# EAGLE design Baseboard_XIAO (EAGLE 9.5.2)
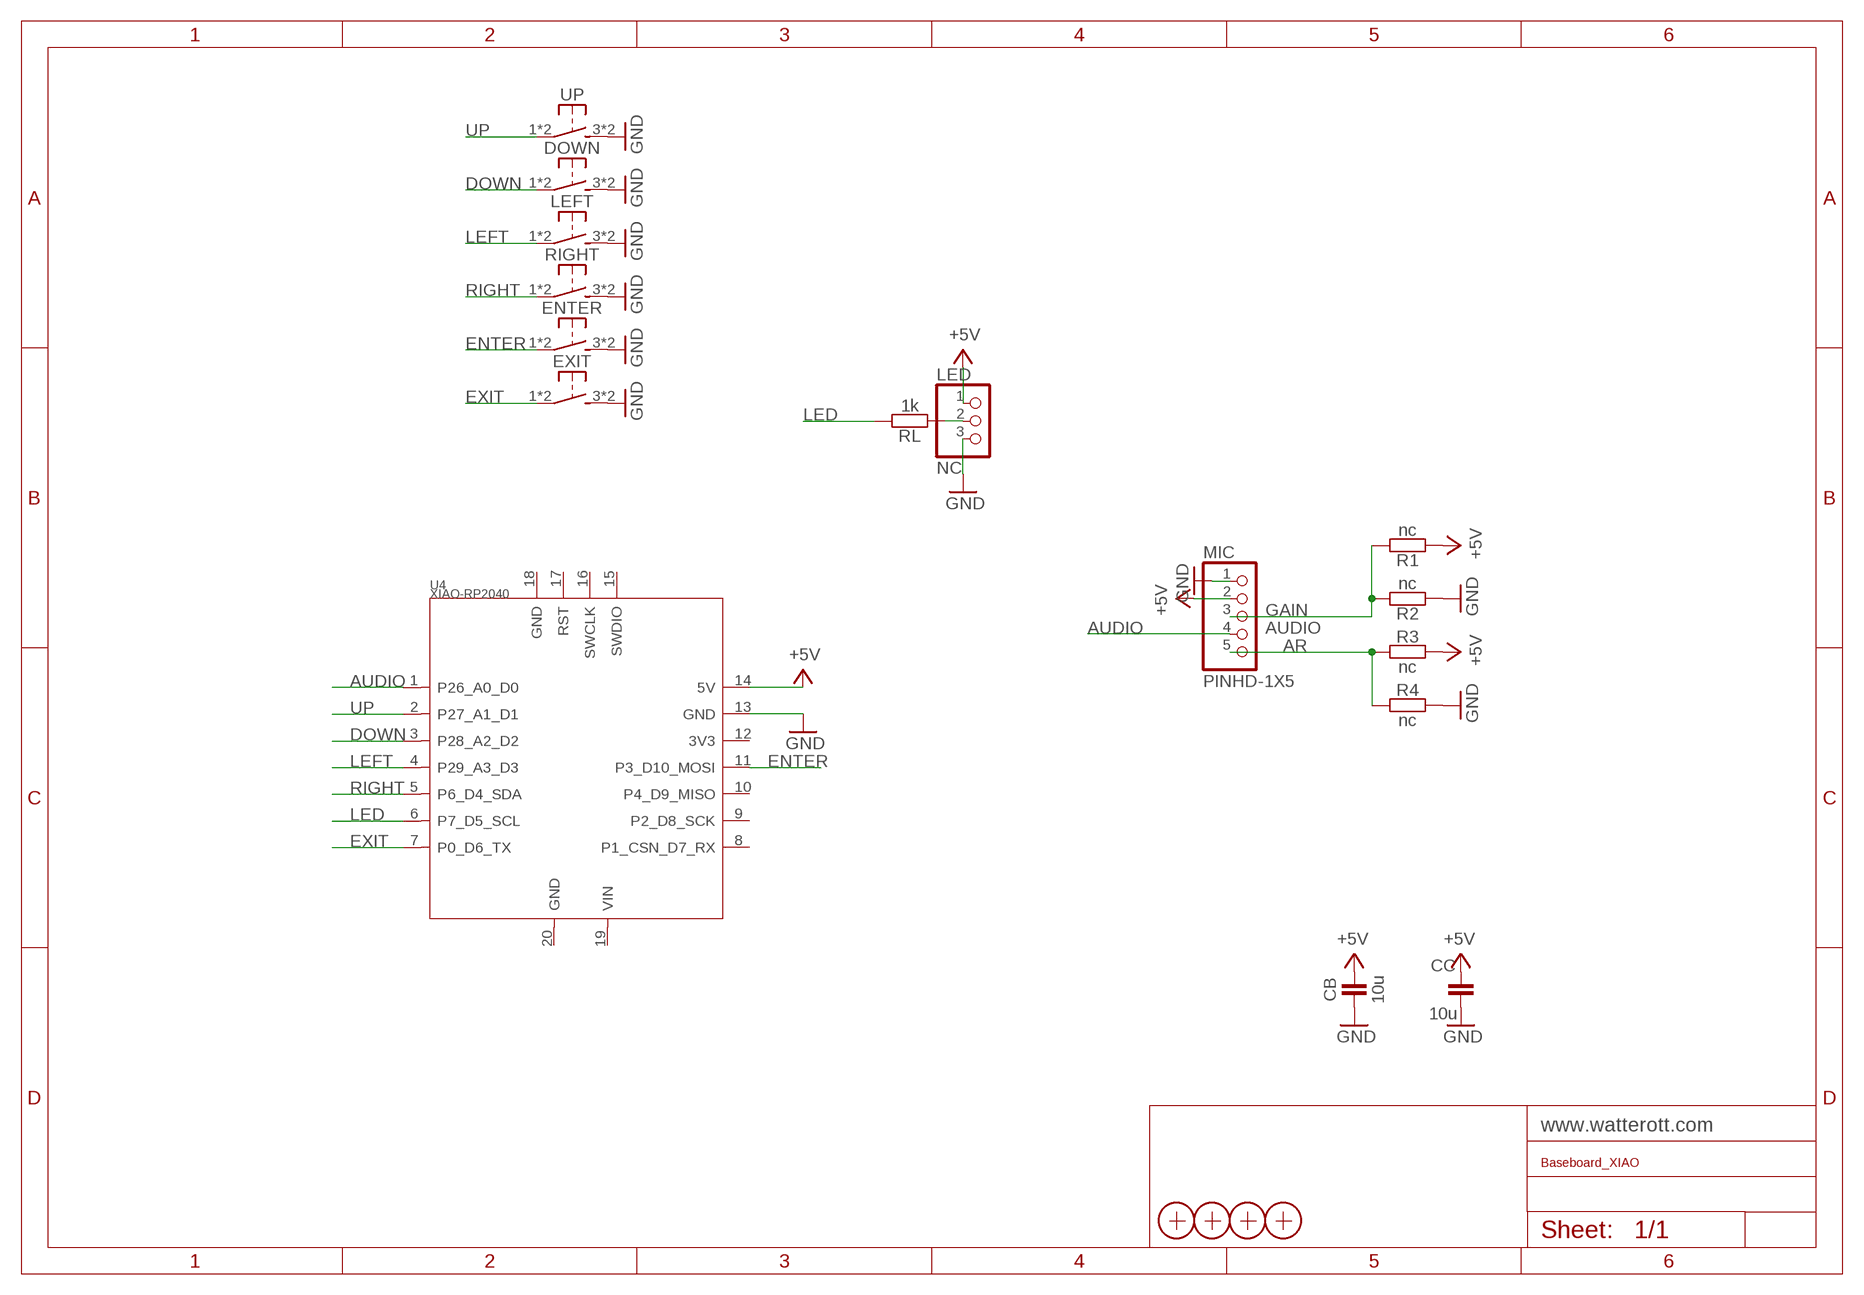
[diagram p0: schematic, sheet 1]

## Parts
CB  10u  CAPACITOR-0603  [C0603]
CC  10u  CAPACITOR-0603  [C0603]
DOWN  SW-TACTILELSH  [SW6XG_LSH]
ENTER  SW-TACTILELSH  [SW6XG_LSH]
EXIT  SW-TACTILELSH  [SW6XG_LSH]
LED  NC  PINHD-1X3  [1X03]
LEFT  SW-TACTILELSH  [SW6XG_LSH]
MIC  PINHD-1X5  [1X05]
R1  nc  RESISTOR-0603  [C0603]
R2  nc  RESISTOR-0603  [C0603]
R3  nc  RESISTOR-0603  [C0603]
R4  nc  RESISTOR-0603  [C0603]
RIGHT  SW-TACTILELSH  [SW6XG_LSH]
RL  1k  RESISTOR-0603  [C0603]
U4  XIAO-RP2040  [XIAO-SAMD21/RP2040-MODULE14P-2.54-21X17.8MM]
UP  SW-TACTILELSH  [SW6XG_LSH]
X1  PASSER-07  [PASSER_07MM]
X2  PASSER-07  [PASSER_07MM]
X3  PASSER-07  [PASSER_07MM]
X4  PASSER-07  [PASSER_07MM]

## Nets
+5V: CB.2 CC.2 LED.1 MIC.2 R1.1 R3.2 U4.14(5V)
AR: MIC.5 R3.1 R4.1
AUDIO: MIC.4 U4.1(P26_A0_D0)
DOWN: DOWN.1 DOWN.2(P1) U4.3(P28_A2_D2)
ENTER: ENTER.1 ENTER.2(P1) U4.11(P3_D10_MOSI)
EXIT: EXIT.1 EXIT.2(P1) U4.7(P0_D6_TX)
GAIN: MIC.3 R1.2 R2.2
GND: CB.1 CC.1 DOWN.3(S1) DOWN.4(S1) ENTER.3(S1) ENTER.4(S1) EXIT.3(S1) EXIT.4(S1) LED.3 LEFT.3(S1) LEFT.4(S1) MIC.1 R2.1 R4.2 RIGHT.3(S1) RIGHT.4(S1) U4.13(GND) UP.3(S1) UP.4(S1)
LED: RL.2 U4.6(P7_D5_SCL)
LEFT: LEFT.1 LEFT.2(P1) U4.4(P29_A3_D3)
N$16: LED.2 RL.1
RIGHT: RIGHT.1 RIGHT.2(P1) U4.5(P6_D4_SDA)
UP: U4.2(P27_A1_D1) UP.1 UP.2(P1)
Unconnected: U4.8(P1_CSN_D7_RX) U4.9(P2_D8_SCK) U4.10(P4_D9_MISO) U4.12(3V3) U4.15(SWDIO) U4.16(SWCLK) U4.17(RST) U4.18(GND) U4.19(VIN) U4.20(GND)

## Library data of the parts
CB CC = we-rcl:CAPACITOR: Capacitor ...2.2uF @ 6.3V -> 0402 ...4.7uF @ 6.3V -> 0603 ...10uF @ 16V -> 0805 ...22uF @ 25V -> 1206
DOWN ENTER EXIT LEFT RIGHT UP = we-switch:SW-TACTILE: Tactile Switche
LED = Connector:PINHD-1X3: PIN HEADER; CATEGORY: CONNECTOR; SUB-CATEGORY: PIN-HEADER
MIC = Connector:PINHD-1X5: PIN HEADER; CATEGORY: CONNECTOR; SUB-CATEGORY: PIN-HEADER
R1-R4 RL = we-rcl:RESISTOR: Resistor all kinds in 0402 and 0603
U4 = Seeed Studio XIAO Series:XIAO-RP2040: Seeed Studio XIAO RP2040 v1.22 - Raspberry Pi RP2040 Microcontroller - 32-bit 133MHz Dual-Core ARM® Cortex® M0+processor Seeed SKU: 102010428 Seeed Studio XIAO RP2040 is a microcontroller using the Raspberry Pi RP2040 chip. The MCU runs at up to 133MHz. It is built with rich interfaces in a tiny thumb size and fully supports Arduino, MicroPython, and CircuitPython. The onboard interfaces are enough for developing multiple applications. Buy now <https://www.seeedstudio.com/XIAO-RP2040-v1-0-p-5026.html> Wiki <https://wiki.seeedstudio.com/XIAO-RP2040/>
X1-X4 = we-symbol:PASSER: Fiducial Marker

## Board
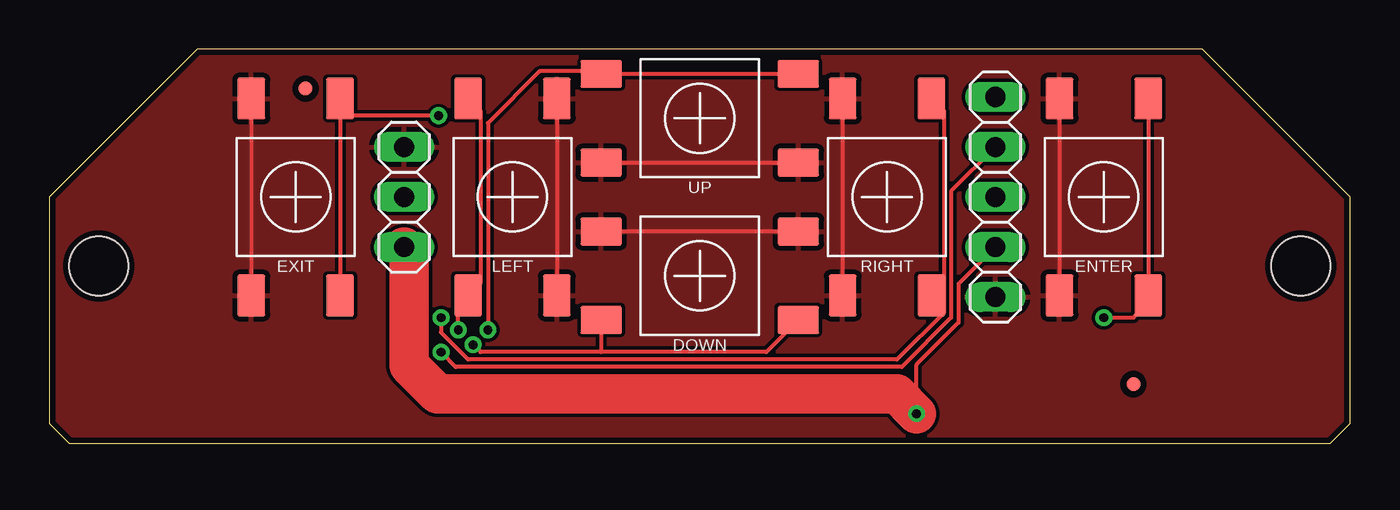
[diagram p1: board, top side]
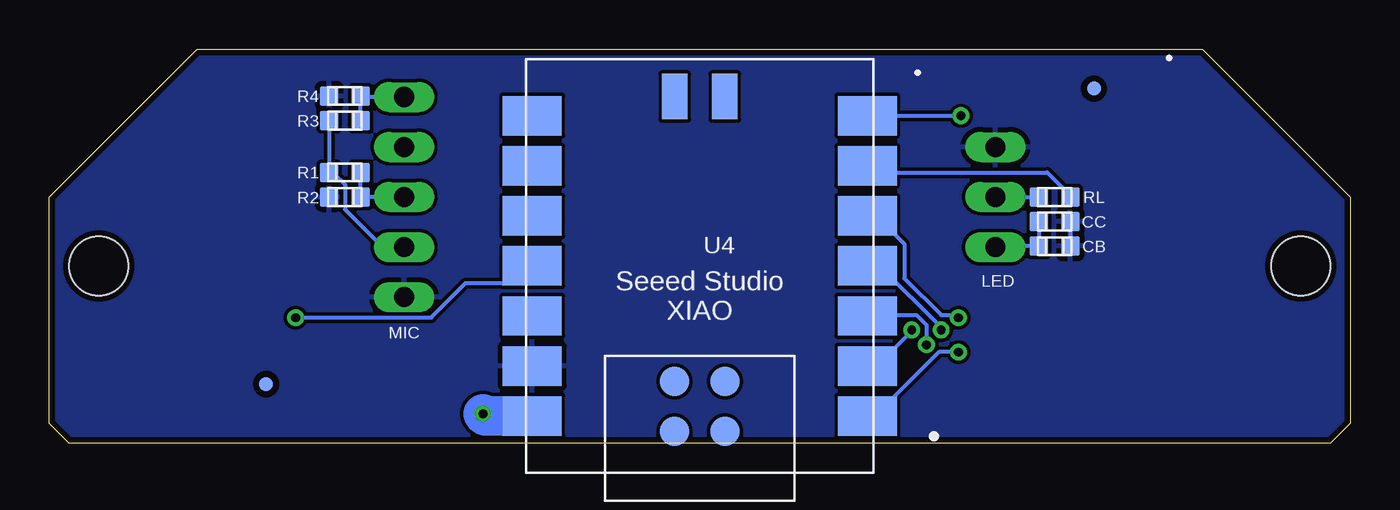
[diagram p2: board, bottom side, seen from below]

Size 66 x 20 mm. Coordinates in mm from the lower left corner, seen from the top.
Outline: 0,12.5 0,1 1,0 65,0 66,1 66,12.5 58.5,20 7.5,20 0,12.5
Copper layers (1*16): Top 0.035mm / dielectric 1.5mm / Bottom 0.035mm
Design rules "aisler_2_layer_simple": minimum track width 0.2mm, minimum drill 0.45mm, track to track 0.175mm, track to pad 0.175mm, pad to pad 0.175mm, via to via 0.175mm, smd to smd 0.175mm, copper to edge 0.3mm, drill to drill 0.25mm, minimum pad ring 0.2mm, minimum via ring 0.2mm, stop-mask expansion 0mil, vias tented up to drill 0mil, thermal gap 10mil
Holes 3 mm at 63.5,9 2.5,9

### Footprints (pad centres in the part's own frame; a part is rotated, then mirrored left to right if it is on the bottom)
C0603 = smd 1 x 0.95: 1 0,0.8; 2 0,-0.8
SW6XG_LSH = smd 2.1 x 1.4: 1 -5,2.25; 2 5,2.25; 3 -5,-2.25; 4 5,-2.25
1X03 = drill 1.016 long: 1 -2.54,0; 2 0,0; 3 2.54,0
1X05 = drill 1.016 long: 1 -5.08,0; 2 -2.54,0; 3 0,0; 4 2.54,0; 5 5.08,0
XIAO-SAMD21/RP2040-MODULE14P-2.54-21X17.8MM = smd 3 x 2: 1 -8.5,7.62; 2 -8.5,5.08; 3 -8.5,2.54; 4 -8.5,0; 5 -8.5,-2.54; 6 -8.5,-5.08; 7 -8.5,-7.62; 8 8.5,-7.62; 9 8.5,-5.08; 10 8.5,-2.54; 11 8.5,0; 12 8.5,2.54; 13 8.5,5.08; 14 8.5,7.62 | smd 1.5 x 1.5: 15 -1.27,8.39; 16 1.27,8.39; 17 -1.27,5.85; 18 1.27,5.85 | smd 1.3 x 2.3: 19 -1.27,-8.6; 20 1.27,-8.6
PASSER_07MM = smd 0.7 x 0.7: X 0,0

### Placement (x,y rotation side)
CB  15,10 270 bottom
CC  15,11.25 270 bottom
DOWN  33,8.5 180 top
ENTER  53.5,12.5 270 top
EXIT  12.5,12.5 270 top
LED  18,12.5 90 top
LEFT  23.5,12.5 90 top
MIC  48,12.5 90 top
R1  51,13.75 90 bottom
R2  51,12.5 90 bottom
R3  51,16.38 270 bottom
R4  51,17.62 270 bottom
RIGHT  42.5,12.5 270 top
RL  15,12.5 90 bottom
U4  33,9 180 bottom
UP  33,16.5 0 top
X1  13,18 180 bottom
X2  55,3 180 bottom
X3  13,18 0 top
X4  55,3 0 top

### Tracks (layer width: path | path; a pad name or v marks a point on that pad's centre or on a via)
+5V  (via drill 0.45)
  Top 0.2: MIC.2 46.12,8.09 46.12,6.12 44,4 v44,1.5
  Top 2: v44,1.5 43,2.5 19.71,2.5 18.25,3.96 18.25,9.71 LED.1
  Bottom 0.2: R3.2 R1.1 51.62,13.75 51,13.12 51,11.88 49.09,9.96 MIC.2 | CC.2 CB.2 17.96,10 LED.1
  Bottom 2: U4.14 43.88,1.38 v44,1.5
AR
  Bottom 0.2: R3.1 R4.1 50.16,17.58 MIC.5
AUDIO  (via drill 0.45)
  Top 0.2: MIC.4 45.75,12.79 45.75,6.38 43.25,3.88 20.62,3.88 v19.88,4.62
  Bottom 0.2: v19.88,4.62 20.88,4.62 24.12,1.38 U4.1
DOWN  (via drill 0.45)
  Top 0.2: 28,4.62 36.38,4.62 DOWN.1 | DOWN.2 28,4.62 | 28,4.62 21.88,4.62 v21.5,5
  Bottom 0.2: U4.3 24.46,6.5 22,6.5 21.5,6 v21.5,5
ENTER  (via drill 0.45)
  Top 0.2: ENTER.1 ENTER.2 55.75,7.12 55,6.38 v53.5,6.38
  Bottom 0.2: U4.11 42.38,8.12 44.88,8.12 46.62,6.38 v53.5,6.38
EXIT  (via drill 0.45)
  Top 0.2: EXIT.2 EXIT.1 14.75,16.62 v19.75,16.62
  Bottom 0.2: v19.75,16.62 U4.7
GAIN
  Bottom 0.2: R1.2 R2.2 MIC.3
GND
  Top 0.2: UP.3 UP.4 | RIGHT.3 RIGHT.4 | DOWN.3 DOWN.4 | LEFT.4 LEFT.3 | EXIT.3 EXIT.4 | ENTER.3 ENTER.4
  Bottom 0.2: CC.1 CB.1
  pour Bottom: 0,20 66,20 66,-1.5 0,-1.5
  pour Top: 0,20 0,0 66,0 66,20
LED
  Bottom 0.2: U4.6 24.17,13.75 15.38,13.75 14.2,12.57 RL.2
LEFT  (via drill 0.45)
  Top 0.2: LEFT.2 21.88,16.88 21.88,8.12 LEFT.1 21.25,7.25 20.75,6.75 v20.75,5.75
  Bottom 0.2: U4.4 23.88,9 20.75,5.88 v20.75,5.75
N$16
  Bottom 0.2: LED.2 RL.1
RIGHT  (via drill 0.45)
  Top 0.2: RIGHT.1 45.38,16.88 45.38,7.5 | RIGHT.2 45.38,7.5 | 45.38,7.5 45.38,6.62 43,4.25 21.25,4.25 19.88,5.62 v19.88,6.38
  Bottom 0.2: U4.5 24.04,11.54 22.62,10.12 22.62,8.38 20.75,6.5 20,6.5 v19.88,6.38
UP  (via drill 0.45)
  Top 0.2: UP.2 UP.1 27.88,18.88 24.88,18.88 22.25,16.25 v22.25,5.75
  Bottom 0.2: v22.25,5.75 22.25,5.67 24,3.92 U4.2

### Text on the board
bNames: MIC